# EAGLE schematic mubi-ESP32-36 (EAGLE 7.2.0)
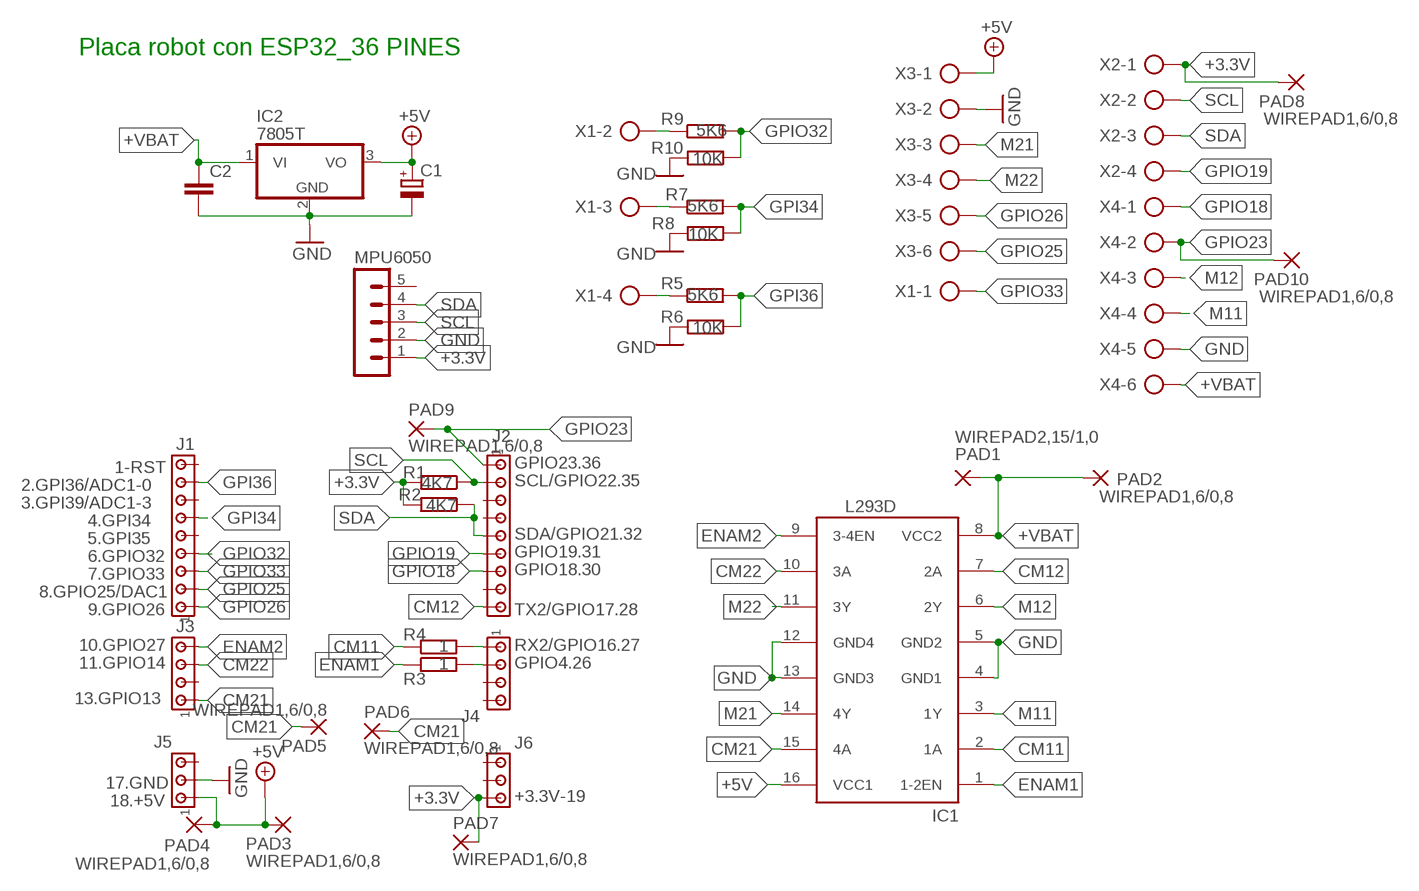
[diagram p0: schematic, sheet 1]

## Parts
C1  CPOL-EUE2.5-6  [E2,5-6]
C2  C-EU025-025X050  [C025-025X050]
IC1  L293D  [DIL16]
IC2  7805T  [TO220H]
J1  MTA09-100  [10X09MTA]
J2  MTA09-100  [10X09MTA]
J3  MTA04-100  [10X04MTA]
J4  MTA04-100  [10X04MTA]
J5  MTA03-100  [10X03MTA]
J6  MTA03-100  [10X03MTA]
MPU6050  MA05-1  [MA05-1]
PAD1  WIREPAD2,15/1,0  [2,15/1,0]
PAD2  WIREPAD1,6/0,8  [1,6/0,8]
PAD3  WIREPAD1,6/0,8  [1,6/0,8]
PAD4  WIREPAD1,6/0,8  [1,6/0,8]
PAD5  WIREPAD1,6/0,8  [1,6/0,8]
PAD6  WIREPAD1,6/0,8  [1,6/0,8]
PAD7  WIREPAD1,6/0,8  [1,6/0,8]
PAD8  WIREPAD1,6/0,8  [1,6/0,8]
PAD9  WIREPAD1,6/0,8  [1,6/0,8]
PAD10  WIREPAD1,6/0,8  [1,6/0,8]
R1  4K7  R-EU_0207/7  [0207/7]
R2  4K7  R-EU_0207/7  [0207/7]
R3  1  R-EU_0207/10  [0207/10]
R4  1  R-EU_0207/10  [0207/10]
R5  5K6  R-EU_0204/5  [0204/5]
R6  10K  R-EU_0204/5  [0204/5]
R7  5K6  R-EU_0204/5  [0204/5]
R8  10K  R-EU_0204/5  [0204/5]
R9  5K6  R-EU_0204/5  [0204/5]
R10  10K  R-EU_0204/5  [0204/5]
X1  AK500/4-H  [AK500/4-H]
X2  AK500/4-H  [AK500/4-H]
X3  AK500/6-H  [AK500/6-H]
X4  AK500/6-H  [AK500/6-H]

## Nets
+3.3V: J6.3 MPU6050.1 PAD7.1(P) PAD8.1(P) R1.2 R2.2 X2.1
+5V: C1.+ IC1.16(VCC1) IC2.3(VO) J5.1 PAD3.1(P) PAD4.1(P) X3.1
+VBAT: C2.1 IC1.8(VCC2) IC2.1(VI) PAD1.1(P) PAD2.1(P) X4.6
CM11: IC1.2(1A) R4.1
CM12: IC1.7(2A) J2.9
CM21: IC1.15(4A) J3.1 PAD5.1(P) PAD6.1(P)
CM22: IC1.10(3A) J3.3
ENAM1: IC1.1(1-2EN) R3.1
ENAM2: IC1.9(3-4EN) J3.4
GND: C1.- C2.2 IC1.4(GND1) IC1.5(GND2) IC1.12(GND4) IC1.13(GND3) IC2.2(GND) J5.2 MPU6050.2 R6.2 R8.2 R10.2 X3.2 X4.5
GPI34: J1.6 R7.2 R8.1
GPI36: J1.8 R5.2 R6.1
GPIO18: J2.7 X4.1
GPIO19: J2.6 X2.4
GPIO23: J2.1 PAD9.1(P) PAD10.1(P) X4.2
GPIO25: J1.2 X3.6
GPIO26: J1.1 X3.5
GPIO32: J1.4 R9.2 R10.1
GPIO33: J1.3 X1.1
M11: IC1.3(1Y) X4.4
M12: IC1.6(2Y) X4.3
M21: IC1.14(4Y) X3.3
M22: IC1.11(3Y) X3.4
N$1: J4.2 R3.2
N$2: J4.1 R4.2
N$3: R5.1 X1.4
N$5: R7.1 X1.3
N$8: R9.1 X1.2
SCL: J2.2 MPU6050.3 R1.1 X2.2
SDA: J2.5 MPU6050.4 R2.1 X2.3
Unconnected: J1.5 J1.7 J1.9 J2.3 J2.4 J2.8 J3.2 J4.3 J4.4 J5.3 J6.1 J6.2 MPU6050.5

## Notes on the sheet
- Placa robot con ESP32_36 PINES
- 1-RST | GPIO23.36
- 2.GPI36/ADC1-0 | SCL/GPIO22.35
- 3.GPI39/ADC1-3
- 4.GPI34
- 5.GPI35 | SDA/GPIO21.32
- 6.GPIO32 | GPIO19.31
- 7.GPIO33 | GPIO18.30
- 8.GPIO25/DAC1
- 9.GPIO26 | TX2/GPIO17.28
- 10.GPIO27 | RX2/GPIO16.27
- 11.GPIO14 | GPIO4.26
- 13.GPIO13
- 17.GND
- 18.+5V | +3.3V-19

## Library data of the parts
C1 = resistor:CPOL-EU: POLARIZED CAPACITOR, European symbol
C2 = rcl:C-EU: CAPACITOR, European symbol
IC1 = st-microelectronics:L293D: PUSH-PULL 4 CHANNEL DRIVER; MPN: L293D; OC_FARNELL: 9589619; OC_NEWARK: 56P8249
IC2 = linear:78*: Positive VOLTAGE REGULATOR Source: http://cache.national.com/ds/LM/LM78L05.pdf http://www.fairchildsemi.com/ds/LM/LM7805.pdf
J1 J2 = con-amp:MTA09-100: AMP connector
J3 J4 = con-amp:MTA04-100: AMP connector
J5 J6 = con-amp:MTA03-100: AMP connector
MPU6050 = con-lstb:MA05-1: PIN HEADER; OC_FARNELL: unknown; OC_NEWARK: unknown
PAD1-PAD10 = wirepad:WIREPAD: Wire PAD connect wire on PCB
R1 R2 = rcl:R-EU_: RESISTOR, European symbol
R3-R10 = resistor:R-EU_: RESISTOR, European symbol
X1 X2 = con-ptr500:AK500/4-H: CONNECTOR Aug. 2004 / PTR Meßtechnik: Die Bezeichnung der Serie AK505 wurde geändert. Es handelt sich hierbei um AK500 in horizontaler Ausführung.; OC_FARNELL: unknown; OC_NEWARK: unknown
X3 X4 = con-ptr500:AK500/6-H: CONNECTOR Aug. 2004 / PTR Meßtechnik: Die Bezeichnung der Serie AK505 wurde geändert. Es handelt sich hierbei um AK500 in horizontaler Ausführung.